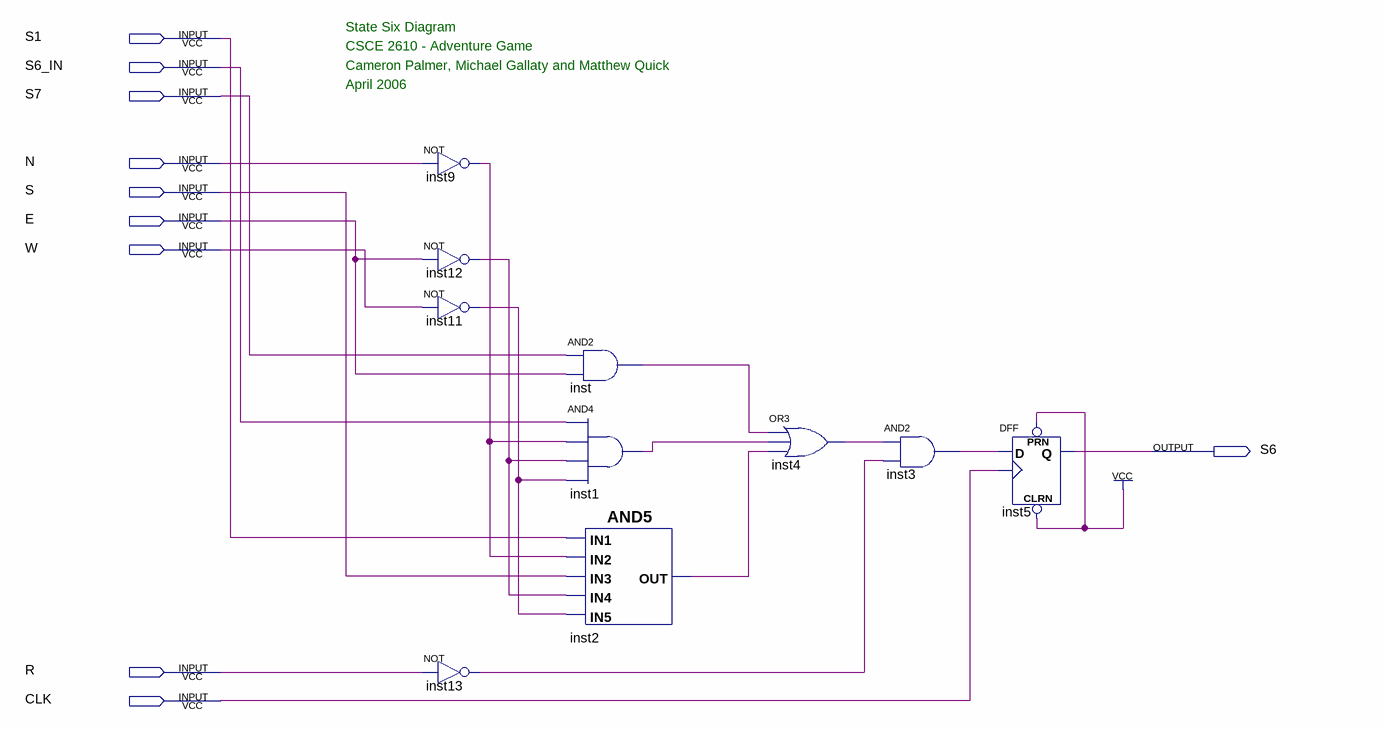
[diagram p0: schematic sheet]
// Quartus schematic state_six.bdf as structural Verilog: 10 symbols, 10 pins
module state_six (
  input  S1,
  input  S6_IN,
  input  S7,
  input  N,
  input  S,
  input  E,
  input  W,
  input  R,
  input  CLK,
  output S6
);

  wire inst1_out, inst2_out, inst3_out, inst4_out, inst9_out, inst11_out, inst12_out, inst13_out, inst_out;

  not inst9 (inst9_out, N);
  not inst12 (inst12_out, E);
  not inst11 (inst11_out, W);
  not inst13 (inst13_out, R);
  and inst (inst_out, S7, E);
  and inst1 (inst1_out, S6_IN, inst9_out, inst12_out, inst11_out);
  and inst2 (inst2_out, S1, inst9_out, S, inst12_out, inst11_out);
  or inst4 (inst4_out, inst_out, inst1_out, inst2_out);
  and inst3 (inst3_out, inst4_out, inst13_out);
  DFF inst5 (.CLRN(1'b1), .CLK(CLK), .D(inst3_out), .PRN(1'b1), .Q(S6));

  // Notes on the sheet:
  //   State Six Diagram
  //   CSCE 2610 - Adventure Game
  //   Cameron Palmer, Michael Gallaty and Matthew Quick
  //   April 2006
endmodule
